# Altium schematic sheet obc-v2_CM4-CSI.SchDoc
size 420 x 297 mm; SheetNumber: 20; SheetTotal: 23
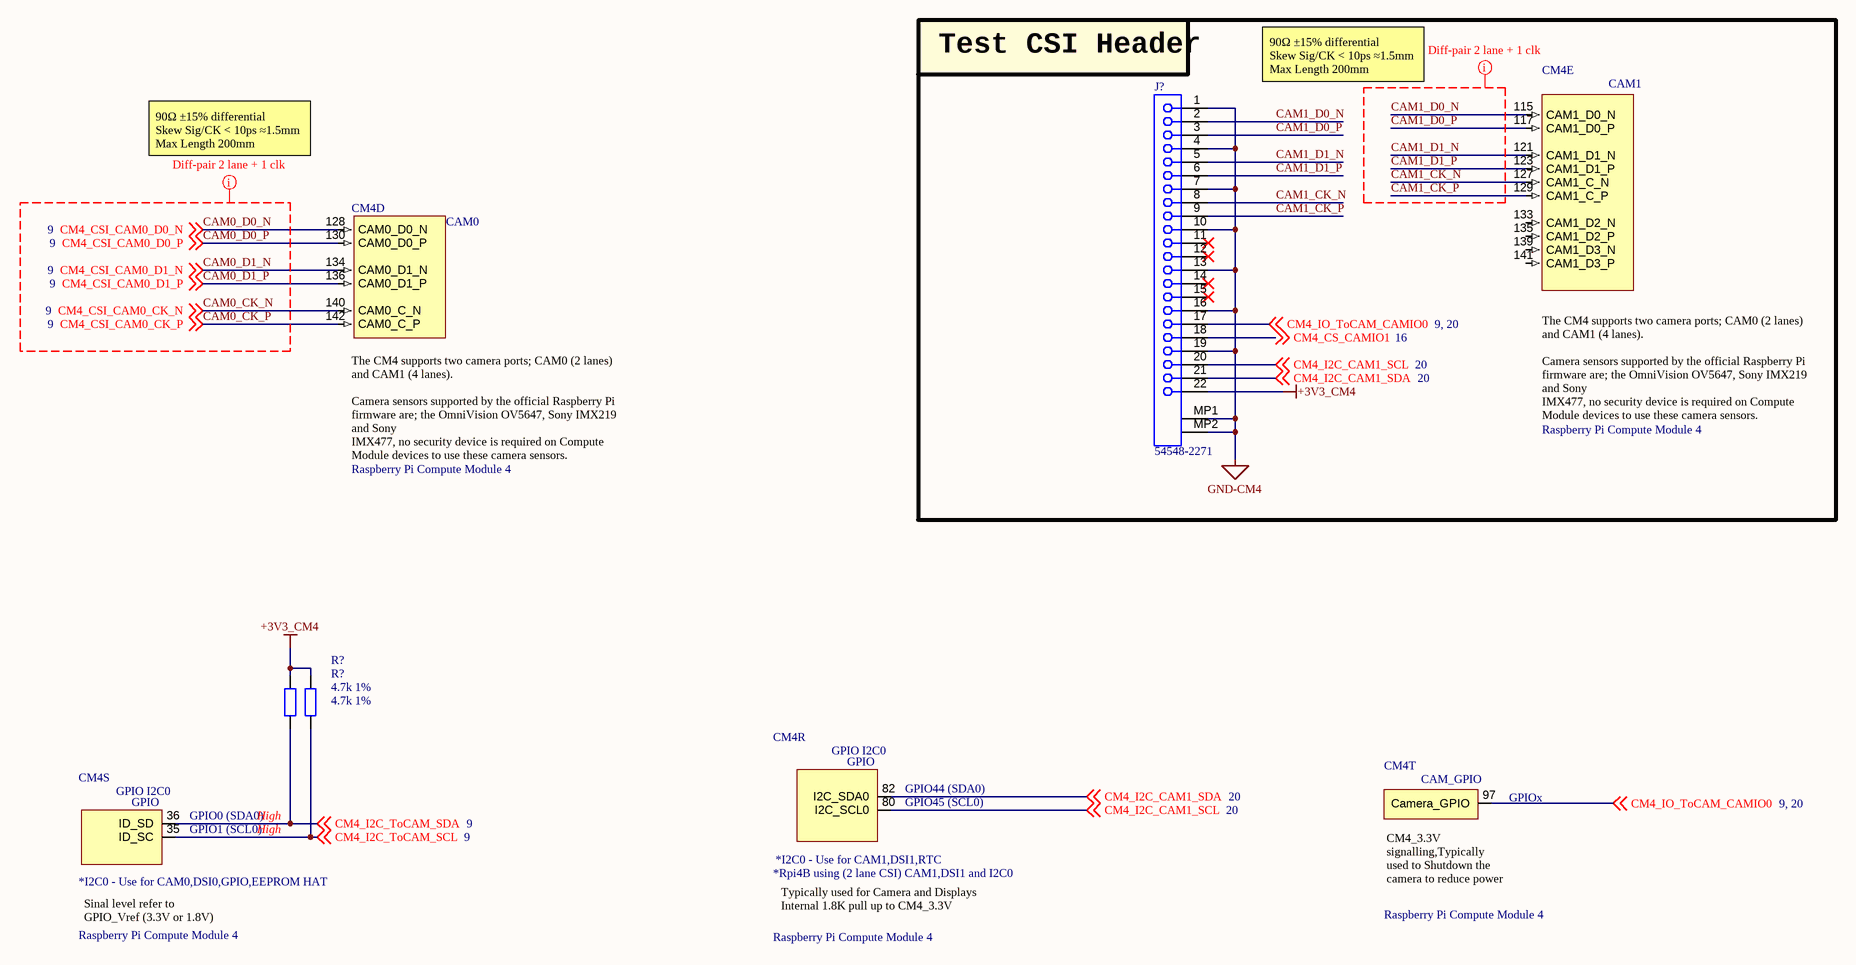
[diagram p0: obc-v2_CM4-CSI.SchDoc]

## Parts
(Parts that share a designator on the sheet are numbered #1, #2 ... from top to bottom, then left to right.)
CM4  Raspberry Pi Compute Module 4  [CM4-DF40HC(3.0)-100DS-0.4v_3mm_1.5mm]  (parts D,E,R,S,T of 21)  (no BOM)
J?  54548-2271  [MOLX-54548-2271]
R?#1  4.7k 1%  [tro smd 0603]
R?#2  4.7k 1%  [tro smd 0603]

## Blocks framed on the sheet
Test CSI Header: CM4 J?

## Nets
+3V3_CM4: J?.22 R?#1.1 R?#2.1
GND-CM4: J?.1 J?.4 J?.7 J?.10 J?.13 J?.16 J?.19 J?.MP1 J?.MP2
CAM0_CK_N: CM4.140(CAM0_C_N) ; off-sheet CM4_CSI_CAM0_CK_N  [also labelled CM4_CSI_CAM0_CK_N]
CAM0_CK_P: CM4.142(CAM0_C_P) ; off-sheet CM4_CSI_CAM0_CK_P  [also labelled CM4_CSI_CAM0_CK_P]
CAM0_D0_N: CM4.128(CAM0_D0_N) ; off-sheet CM4_CSI_CAM0_D0_N  [also labelled CM4_CSI_CAM0_D0_N]
CAM0_D0_P: CM4.130(CAM0_D0_P) ; off-sheet CM4_CSI_CAM0_D0_P  [also labelled CM4_CSI_CAM0_D0_P]
CAM0_D1_N: CM4.134(CAM0_D1_N) ; off-sheet CM4_CSI_CAM0_D1_N  [also labelled CM4_CSI_CAM0_D1_N]
CAM0_D1_P: CM4.136(CAM0_D1_P) ; off-sheet CM4_CSI_CAM0_D1_P  [also labelled CM4_CSI_CAM0_D1_P]
CAM1_CK_N: CM4.127(CAM1_C_N) J?.8
CAM1_CK_P: CM4.129(CAM1_C_P) J?.9
CAM1_D0_N: CM4.115(CAM1_D0_N) J?.2
CAM1_D0_P: CM4.117(CAM1_D0_P) J?.3
CAM1_D1_N: CM4.121(CAM1_D1_N) J?.5
CAM1_D1_P: CM4.123(CAM1_D1_P) J?.6
CM4_CS_CAMIO1: J?.18 ; off-sheet CM4_CS_CAMIO1
CM4_I2C_CAM1_SCL: CM4.80(I2C_SCL0) J?.20 ; off-sheet CM4_I2C_CAM1_SCL
CM4_I2C_CAM1_SDA: CM4.82(I2C_SDA0) J?.21 ; off-sheet CM4_I2C_CAM1_SDA
CM4_I2C_ToCAM_SCL: CM4.35(ID_SC) R?#2.2 ; off-sheet CM4_I2C_ToCAM_SCL
CM4_I2C_ToCAM_SDA: CM4.36(ID_SD) R?#1.2 ; off-sheet CM4_I2C_ToCAM_SDA
CM4_IO_ToCAM_CAMIO0: CM4.97(Camera_GPIO) J?.17 ; off-sheet CM4_IO_ToCAM_CAMIO0

Not connected (* = marked no-connect by the designer): CM4 133(CAM1_D2_N) 135(CAM1_D2_P) 139(CAM1_D3_N) 141(CAM1_D3_P); J? 11* 12* 14* 15*

## Layout directives
mark named Diff-pair 2 lane + 1 clk: CAM0_CK_N, CAM0_CK_P, CAM0_D0_N, CAM0_D0_P, CAM0_D1_N, CAM0_D1_P, CAM1_CK_N, CAM1_CK_P, CAM1_D0_N, CAM1_D0_P, CAM1_D1_N, CAM1_D1_P, CM4_CSI_CAM0_CK_N, CM4_CSI_CAM0_CK_P, CM4_CSI_CAM0_D0_N, CM4_CSI_CAM0_D0_P, CM4_CSI_CAM0_D1_N, CM4_CSI_CAM0_D1_P

## Notes on the sheet
- 90Ω ±15% differential
  Skew Sig/CK < 10ps ≈1.5mm
  Max Length 200mm
- Project:
- Sub-system:
- Design by:
- Sheet title:
- Sheet
- A3
- of
- Checked by:
- Approved by:
- Revision:
- Document No:
- Size:
- Date:
- (in symbol CM4, part D) CAM0; The CM4 supports two camera ports; CAM0 (2 lanes) and CAM1 (4 lanes). / Camera sensors supported by the official Raspberry Pi firmware are; the OmniVision OV5647, Sony IMX219 and Sony / IMX477, no security device is required on Compute Module devices to use these camera sensors.
- (in symbol CM4, part E) CAM1; The CM4 supports two camera ports; CAM0 (2 lanes) and CAM1 (4 lanes). / Camera sensors supported by the official Raspberry Pi firmware are; the OmniVision OV5647, Sony IMX219 and Sony / IMX477, no security device is required on Compute Module devices to use these camera sensors.
- (in symbol CM4, part R) GPIO I2C0; GPIO; GPIO44 (SDA0); GPIO45 (SCL0); *I2C0 - Use for CAM1,DSI1,RTC; *Rpi4B using (2 lane CSI) CAM1,DSI1 and I2C0; Typically used for Camera and Displays Internal 1.8K pull up to CM4_3.3V
- (in symbol CM4, part S) GPIO I2C0; GPIO; GPIO0 (SDA0); High; GPIO1 (SCL0); *I2C0 - Use for CAM0,DSI0,GPIO,EEPROM HAT; Sinal level refer to  GPIO_Vref (3.3V or 1.8V)
- (in symbol CM4, part T) CAM_GPIO; GPIOx; CM4_3.3V signalling,Typically used to Shutdown the camera to reduce power

## Library data of the parts
CM4 = CM4: Raspberry Pi Compute Module 4 by Amornthep Phunsin
J? = CMP-1241-00555-1: 0.5 mm Pitch Easy-On(TM) Type FPC Connector, 1.2 mm Mated Height, Right Angle, ZIF, SMT, Bottom Contact, 22 Circuits, -20 to 85 degC, ELV and RoHS Compliant, Tape and Reel; Manufacturer: Molex; Circuits (Loaded): 22; Stackable: No; Material - Plating Termination: Tin; PCB Retention: Yes; Entry Angle: 90degrees Angle; Material - Plating Mating: Gold; Current (Max per Contact): 0.5A; Material - Metal: Phosphor Bronze; Voltage (Max): 50V; Mated Height: 1.20mm; Pitch - Mating Interface: 0.50mm; Durability (mating cycles max): 20; PackageVersion: Rev. N, 06/2008; PackageDescription: 22-Lead FPC Connector, Pitch 0.5 mm; PackageReference: 54548-2271; ComponentLink2Description: Datasheet; PartNumber: 54548-2271; ComponentLink3URL: http://www.molex.com/pdm_docs/sd/545482171_sd.pdf; Contact Position: Bottom; Packing: Tape and Reel; ComponentLink1URL: http://www.molex.com/molex/index.jsp; Mounting Technology: Surface Mount; ComponentLink3Description: Package Specification; PCB Locator: No; ComponentLink2URL: http://www.molex.com/webdocs/datasheets/pdf/en-us/0545482271_FFC_FPC_CONNECTORS.pdf; Orientation: Right Angle; Number of Rows: 1; RoHS: TRUE; Polarized to PCB: Yes; ComponentLink1Description: Manufacturer URL
R?#1 R?#2 = Tro 0603 1% 10k: RES SMD 2.2K OHM 1% 1/10W 0603, P/N: ERJ-3EKF2201V; Chung_Loai: Dán; Don_Vi: Con; So_Chan: 2; Ten_Linh_Kien: Trở 0603 1% 10k; Ma_Hang: MH006333; Kieu_Chan: *